# Altium schematic sheet 6.CLCD.SchDoc: CHARACTER LCD
size A; SheetNumber: 6; SheetTotal: 16
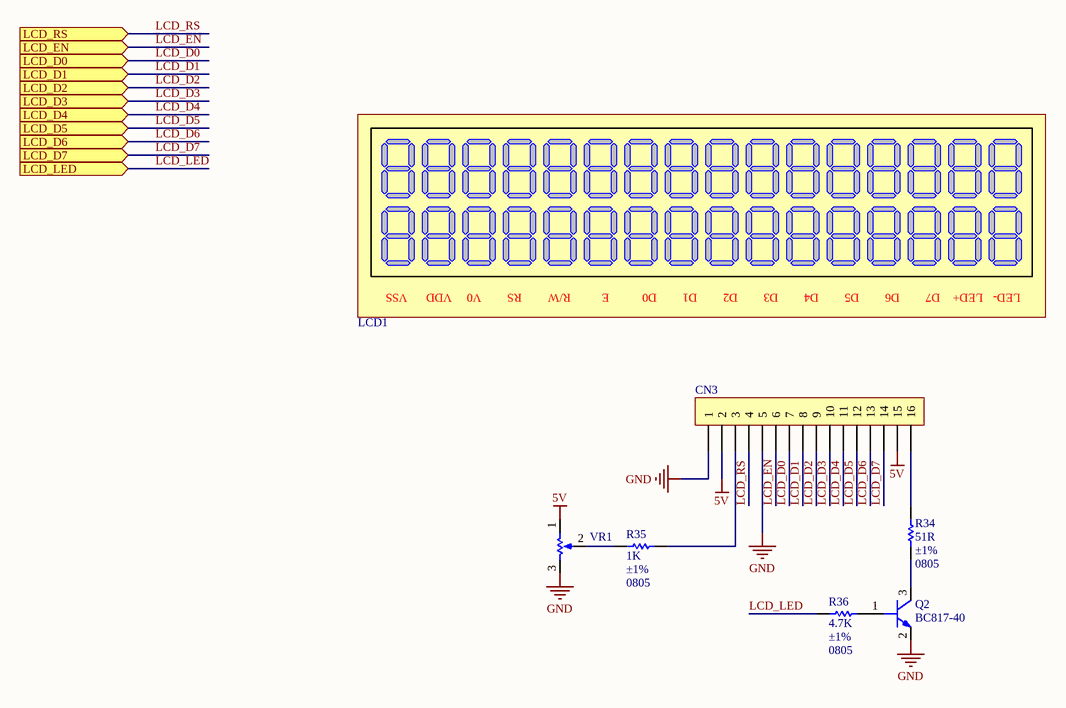
[diagram p0: 6.CLCD.SchDoc]

## Parts
CN3  HDR_1X16  [HDRFV16W70P254_1X16_4064X254X1118P]  (value not drawn)
LCD1  HD44780  [HD44780]  (value not drawn)
Q2  value BC817-40  [SOT95P230X110-3N_SOT-23]  (hidden comment: BC817)
R34  value 51R  Tolerance: ±1%  Package / Case: 0805  [RESC2013X65N_EIA0805]  (hidden comment: RES)
R35  value 1K  Tolerance: ±1%  Package / Case: 0805  [RESC2013X65N_EIA0805]  (hidden comment: RES)
R36  value 4.7K  Tolerance: ±1%  Package / Case: 0805  [RESC2013X65N_EIA0805]  (hidden comment: RES)
VR1  POT  [TRIMMER_SMD]  (value not drawn)

## Ports
LCD_D0 (in), LCD_D1 (in), LCD_D2 (in), LCD_D3 (in), LCD_D4 (in), LCD_D5 (in), LCD_D6 (in), LCD_D7 (in), LCD_EN (in), LCD_LED (in), LCD_RS (in)

## Nets
5V: CN3.2 CN3.15 VR1.1(TOP)
GND: CN3.1 CN3.5 Q2.2(E) VR1.3(BOT)
LCD_D0: CN3.7 ; port LCD_D0
LCD_D1: CN3.8 ; port LCD_D1
LCD_D2: CN3.9 ; port LCD_D2
LCD_D3: CN3.10 ; port LCD_D3
LCD_D4: CN3.11 ; port LCD_D4
LCD_D5: CN3.12 ; port LCD_D5
LCD_D6: CN3.13 ; port LCD_D6
LCD_D7: CN3.14 ; port LCD_D7
LCD_EN: CN3.6 ; port LCD_EN
LCD_LED: R36.2 ; port LCD_LED
LCD_RS: CN3.4 ; port LCD_RS
NetCN3_3: CN3.3 R35.1
NetCN3_16: CN3.16 R34.1
NetQ2_1: Q2.1(B) R36.1
NetQ2_3: Q2.3(C) R34.2
NetR35_2: R35.2 VR1.2(TAP)

## Notes on the sheet
- (in symbol SOPT00201) VSS; VDD; V0; RS; R/W; E; D0; D1; D2; D3; D4; D5; D6; D7; LED+; LED-

## Library data of the parts
CN3 = SCON00136: CONN HEADER FEMALE 16POS.1" TIN; Manufacturer: Sullins Connector Solutions; Manufacturer Part Number: PPTC161LFBN-RC; Pitch: 2.54mm; Cost x1 ($): 1.22000; Cost x10 ($): 1.01500; Cost x100 ($): 0.75200; Cost x1000 ($): 0.54520; Distrubutor: Digikey; Lead Time: 3 Weeks; Part Number: SCON00136; Value: HDR_1X16; Category: Connectors, Interconnects; Family: Rectangular Connectors - Headers, Receptacles, Female Sockets; Connector Type: Header; Contact Type: Female Socket; Mounting Type: Through Hole; Contact Finish: Tin; Distributor Part Number: S7014-ND; Datasheet Link: http://www.digikey.com/product-detail/en/sullins-connector-solutions/PPTC161LFBN-RC/S7014-ND/810154; ROHS: YES; Moisture Sensitivity Level (MSL): 1 (Unlimited); Part Status: Active; Quantity: 0
LCD1 = SOPT00201: LCD MODULE 16X2 CHARACTER; Manufacturer: AV-DISPLAY; Manufacturer Part Number: HY-1602F; Value: 1602_CHAR_LCD; Voltage: 5V; Cost x1 ($): $4.00; Part Number: SOPT00201; Category: Optoelectronics; Family: Display Modules - LCD, OLED Character and Numeric; Type: STN - Super-Twisted Nematic; ROHS: YES; Quantity: 3
Q2 = STRANS00034: TRANS NPN 45V 0.5A SOT23; Manufacturer: NXP Semiconductors; Manufacturer Part Number: BC817-40,215; Ic (Max): 500mA; Vce Saturation (Max) @ Ib, Ic: 700mV @ 50mA, 500mA; Ic Cutoff (Max): 100nA (ICBO); hFE (Min) @ Ic, Vce: 250 @ 100mA, 1V; Power - Max: 250mW; Frequency - Transition: 100MHz; Cost x10 ($): 0.12700; Cost x100 ($): 0.06930; Cost x1000 ($): 0.02905; Distrubutor: Digikey; Lead Time: 6 Weeks; Cost x1 ($): 0.14000; Part Number: STRANS00034; Vce Breakdown (Max): 45V; Mounting Type: SMD; Category: Discrete Semiconductor Products; Family: Transistors (BJT) - Single; Transistor Type: NPN; Package / Case: SOT-23-3, TO-236-3, SC-59; Distributor Part Number: 568-1631-1-ND; ROHS: YES; Datasheet Link: http://www.digikey.com/product-detail/en/nxp-semiconductors/BC817-40,215/568-1631-1-ND/763458; Quantity: 110
R34 = SRES03010043: RES SMD 51 OHM 1% 1/8W 0805; Manufacturer: Yageo; Manufacturer Part Number: RC0805FR-0751RL; Resistance (Ohm): 51; Power (Watts): 0.125W, 1/8W; Cost x1 ($): 0.10; Cost x10 ($): 0.21; Cost x100 ($): 0.84; Cost x1000 ($): 3.79; Distrubutor: Digikey; Part Number: SRES03010043; Category: Resistors; Family: Chip Resistor - Surface Mount; Distributor Part Number: 311-51.0CRCT-ND; Distributor Link: http://www.digikey.com/product-detail/en/RC0805FR-0751RL/311-51.0CRCT-ND/730959; ROHS: YES; Quantity: 0
R35 = SRES03010074: RES SMD 1K OHM 1% 1/8W 0805; Manufacturer: Yageo; Manufacturer Part Number: RC0805FR-071KL; Power (Watts): 0.125W, 1/8W; Cost x1 ($): 0.10; Cost x10 ($): 0.21; Cost x100 ($): 0.84; Cost x1000 ($): 3.79; Distrubutor: Digikey; Part Number: SRES03010074; Resistance (Ohm): 1K; Category: Resistors; Family: Chip Resistor - Surface Mount; Distributor Part Number: 311-1.00KCRCT-ND; Distributor Link: http://www.digikey.com/product-detail/en/RC0805FR-071KL/311-1.00KCRCT-ND/730391; ROHS: YES; Quantity: 0
R36 = SRES03010090: RES SMD 4.7K OHM 1% 1/8W 0805; Manufacturer: Yageo; Manufacturer Part Number: RC0805FR-074K7L; Power (Watts): 0.125W, 1/8W; Cost x1 ($): 0.10; Cost x10 ($): 0.21; Cost x100 ($): 0.84; Cost x1000 ($): 3.79; Distrubutor: Digikey; Part Number: SRES03010090; Resistance (Ohm): 4.7K; Category: Resistors; Family: Chip Resistor - Surface Mount; Distributor Part Number: 311-4.70KCRCT-ND; Distributor Link: http://www.digikey.com/product-detail/en/RC0805FR-074K7L/311-4.70KCRCT-ND/730876; ROHS: YES; Quantity: 0
VR1 = SPOT00047: TRIMMER 10K OHM 0.15W SMD; Manufacturer: Panasonic Electronic Components; Manufacturer Part Number: EVM-3YSX50B14; Tolerance: ±25%; Cost x10 ($): 0.33000; Cost x100 ($): 0.27200; Cost x1000 ($): 0.18426; Distrubutor: Digikey; Lead Time: 11 Weeks; Part Number: SPOT00047; Value: TRIMMER10K; Category: Potentiometers, Variable Resistors; Resistance (Ohms): 10k; Power (Watts): 0.15W; Package: SMD; Family: Trimmer Potentiometers; Type: Top Adjustment; Distributor Part Number: P3Y103CT-ND; ROHS: YES; Datasheet Link: http://www.digikey.com/product-detail/en/EVM-3YSX50B14/P3Y103CT-ND/259859; Quantity: 10; Cost x1 ($): 0.33000